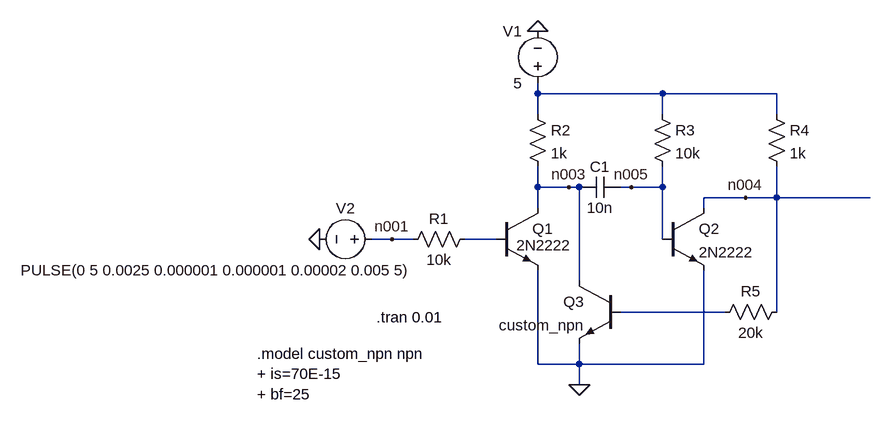
[diagram p0: schematic c02ex03s01.asc]
c02ex03s01.asc, the LTspice schematic file:
Version 4
SHEET 1 880 680
WIRE 192 32 192 16
WIRE 384 32 192 32
WIRE 560 32 384 32
WIRE 192 64 192 32
WIRE 384 64 384 32
WIRE 560 64 560 32
WIRE 192 176 192 144
WIRE 240 176 192 176
WIRE 256 176 240 176
WIRE 336 176 320 176
WIRE 384 176 384 144
WIRE 384 176 336 176
WIRE 512 192 448 192
WIRE 560 192 560 144
WIRE 560 192 512 192
WIRE 704 192 560 192
WIRE 192 208 192 176
WIRE 448 208 448 192
WIRE -32 256 -64 256
WIRE 0 256 -32 256
WIRE 128 256 80 256
WIRE 384 256 384 176
WIRE 256 320 256 176
WIRE 480 368 320 368
WIRE 560 368 560 192
WIRE 192 448 192 304
WIRE 256 448 256 416
WIRE 256 448 192 448
WIRE 448 448 448 304
WIRE 448 448 256 448
WIRE 256 480 256 448
FLAG 192 -64 0
FLAG -144 256 0
FLAG 512 192 n004
FLAG -32 256 n001
FLAG 336 176 n005
FLAG 240 176 n003
FLAG 256 480 0
SYMBOL voltage 192 32 R180
WINDOW 0 24 96 Left 2
WINDOW 3 24 16 Left 2
WINDOW 123 0 0 Left 0
WINDOW 39 0 0 Left 0
SYMATTR InstName V1
SYMATTR Value 5
SYMBOL res 96 240 R90
WINDOW 0 0 56 VBottom 2
WINDOW 3 32 56 VTop 2
SYMATTR InstName R1
SYMATTR Value 10k
SYMBOL voltage -48 256 R90
WINDOW 0 -32 56 VBottom 2
WINDOW 3 32 252 VTop 2
WINDOW 123 0 0 Left 0
WINDOW 39 0 0 Left 0
SYMATTR InstName V2
SYMATTR Value PULSE(0 5 0.0025 0.000001 0.000001 0.00002 0.005 5)
SYMBOL res 176 48 R0
SYMATTR InstName R2
SYMATTR Value 1k
SYMBOL res 368 48 R0
SYMATTR InstName R3
SYMATTR Value 10k
SYMBOL res 544 48 R0
SYMATTR InstName R4
SYMATTR Value 1k
SYMBOL npn 128 208 R0
WINDOW 3 31 57 Left 2
SYMATTR InstName Q1
SYMATTR Value 2N2222
SYMBOL npn 384 208 R0
SYMATTR InstName Q2
SYMATTR Value 2N2222
SYMBOL cap 256 192 R270
WINDOW 0 32 32 VTop 2
WINDOW 3 0 32 VBottom 2
SYMATTR InstName C1
SYMATTR Value 10n
SYMBOL res 576 352 R90
WINDOW 0 0 56 VBottom 2
WINDOW 3 32 56 VTop 2
SYMATTR InstName R5
SYMATTR Value 20k
SYMBOL npn 320 320 M0
SYMATTR InstName Q3
SYMATTR Value custom_npn
TEXT -56 376 Left 2 !.tran 0.01
TEXT -240 432 Left 2 !.model custom_npn npn\n+ is=70E-15\n+ bf=25

The netlist it stands for:
* c02ex03s01.asc
V1 N002 0 5
R1 N006 n001 10k
V2 n001 0 PULSE(0 5 0.0025 0.000001 0.000001 0.00002 0.005 5)
R2 N002 n003 1k
R3 N002 n005 10k
R4 N002 n004 1k
Q1 n003 N006 0 0 2N2222
Q2 n004 n005 0 0 2N2222
C1 n003 n005 10n
R5 n004 N007 20k
Q3 n003 N007 0 0 custom_npn
.model NPN NPN
.model PNP PNP
.lib standard.bjt
.tran 0.01
.model custom_npn npn
+ is=70E-15
+ bf=25
.backanno
.end